# Altium schematic sheet PWR.SchDoc
size A4; SheetNumber: 8; SheetTotal: 8
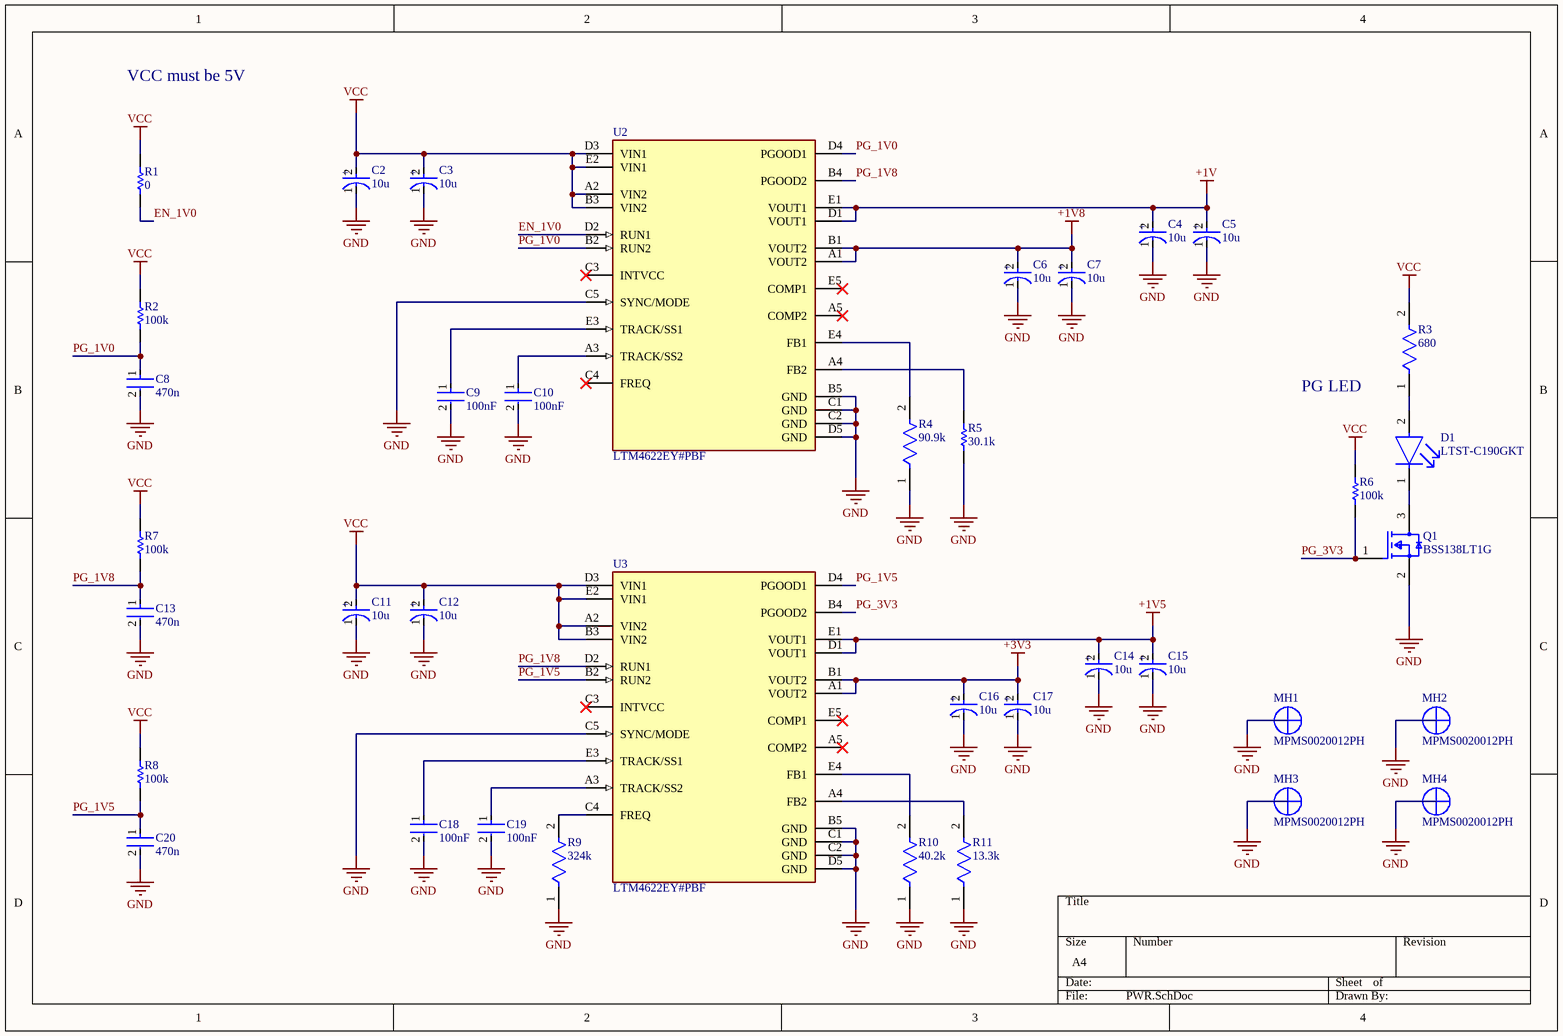
[diagram p0: PWR.SchDoc]

## Parts
C2  10u  [FP-TAJB-MFG]
C3  10u  [FP-TAJB-MFG]
C4  10u  [FP-TAJA-MFG]
C5  10u  [FP-TAJA-MFG]
C6  10u  [FP-TAJA-MFG]
C7  10u  [FP-TAJA-MFG]
C8  470n  [FP-C0603C-CF-MFG]
C9  100nF  [FP-CC0603-DA-MFG]
C10  100nF  [FP-CC0603-DA-MFG]
C11  10u  [FP-TAJB-MFG]
C12  10u  [FP-TAJB-MFG]
C13  470n  [FP-C0603C-CF-MFG]
C14  10u  [FP-TAJA-MFG]
C15  10u  [FP-TAJA-MFG]
C16  10u  [FP-TAJA-MFG]
C17  10u  [FP-TAJA-MFG]
C18  100nF  [FP-CC0603-DA-MFG]
C19  100nF  [FP-CC0603-DA-MFG]
C20  470n  [FP-C0603C-CF-MFG]
D1  LTST-C190GKT  [FP-LTST-C190GKT-MFG]
MH1  MPMS0020012PH  [BF-MPMS0020012PH]
MH2  MPMS0020012PH  [BF-MPMS0020012PH]
MH3  MPMS0020012PH  [BF-MPMS0020012PH]
MH4  MPMS0020012PH  [BF-MPMS0020012PH]
Q1  BSS138LT1G  [FP-318-MFG]
R1  0  [RESC1608X55X25ML10T15]
R2  100k  [RESC3116X65X40ML10T20]
R3  680  [FP-RT0603-MFG]
R4  90.9k  [FP-RT0603-MFG]
R5  30.1k  [RESC0603(1608)_N]
R6  100k  [RESC3116X65X40ML10T20]
R7  100k  [RESC3116X65X40ML10T20]
R8  100k  [RESC3116X65X40ML10T20]
R9  324k  [FP-RT0603-MFG]
R10  40.2k  [FP-RT0603-MFG]
R11  13.3k  [FP-RT0603-MFG]
U2  LTM4622EY#PBF  [FP-BGA-25-05-08-1502-MFG]
U3  LTM4622EY#PBF  [FP-BGA-25-05-08-1502-MFG]

## Nets
+1V: C4.2(A) C5.2(A) U2.D1(VOUT1) U2.E1(VOUT1)
+1V5: C14.2(A) C15.2(A) U3.D1(VOUT1) U3.E1(VOUT1)
+1V8: C6.2(A) C7.2(A) U2.A1(VOUT2) U2.B1(VOUT2)
+3V3: C16.2(A) C17.2(A) U3.A1(VOUT2) U3.B1(VOUT2)
GND: C2.1(C) C3.1(C) C4.1(C) C5.1(C) C6.1(C) C7.1(C) C8.2 C9.2 C10.2 C11.1(C) C12.1(C) C13.2 C14.1(C) C15.1(C) C16.1(C) C17.1(C) C18.2 C19.2 C20.2 MH1.1 MH2.1 MH3.1 MH4.1 Q1.2(S) R4.1 R5.1 R9.1 R10.1 R11.1 U2.B5(GND) U2.C1(GND) U2.C2(GND) U2.C5(SYNC/MODE) U2.D5(GND) U3.B5(GND) U3.C1(GND) U3.C2(GND) U3.C5(SYNC/MODE) U3.D5(GND)
VCC: C2.2(A) C3.2(A) C11.2(A) C12.2(A) R1.2 R2.2 R3.2 R6.2 R7.2 R8.2 U2.A2(VIN2) U2.B3(VIN2) U2.D3(VIN1) U2.E2(VIN1) U3.A2(VIN2) U3.B3(VIN2) U3.D3(VIN1) U3.E2(VIN1)
EN_1V0: R1.1 U2.D2(RUN1)
PG_1V0: C8.1 R2.1 U2.B2(RUN2) U2.D4(PGOOD1)
PG_1V5: C20.1 R8.1 U3.B2(RUN2) U3.D4(PGOOD1)
PG_1V8: C13.1 R7.1 U2.B4(PGOOD2) U3.D2(RUN1)
PG_3V3: Q1.1(G) R6.1 U3.B4(PGOOD2)
NetC9_1: C9.1 U2.E3(TRACK/SS1)
NetC10_1: C10.1 U2.A3(TRACK/SS2)
NetC18_1: C18.1 U3.E3(TRACK/SS1)
NetC19_1: C19.1 U3.A3(TRACK/SS2)
NetD1_1: D1.1(C) Q1.3(D)
NetD1_2: D1.2(A) R3.1
NetR4_2: R4.2 U2.E4(FB1)
NetR5_2: R5.2 U2.A4(FB2)
NetR9_2: R9.2 U3.C4(FREQ)
NetR10_2: R10.2 U3.E4(FB1)
NetR11_2: R11.2 U3.A4(FB2)

Not connected (* = marked no-connect by the designer): U2 A5(COMP2)* C3(INTVCC)* C4(FREQ)* E5(COMP1)*; U3 A5(COMP2)* C3(INTVCC)* E5(COMP1)*

## Notes on the sheet
- VCC must be 5V
- PG LED
- (in symbol CMP-2000-07217-2) +
- (in symbol CMP-04424-000481-1) +

## Library data of the parts
C2 C3 C11 C12 = CMP-04424-000481-1: 10uF 25V  ±10% 2.5Ω 1210  SMD Tantalum Capacitor; ESR (Equivalent Series Resistance): 2.5R; Polarity: Polar; Dissipation Factor: 6%; Leakage Current: 2.5uA; Lead Free: Lead Free; Capacitance: 10uF; Voltage Rating: 25V; Mount: Surface Mount; Packaging: Tape and Reel; Min Operating Temperature: -55°C; Weight: 0.000564oz; Series: TAJ; Case/Package: 1210; Width: 0.11inch; Height - Seated (Max): 0.083inch; RoHS Compliant: Yes; Height: 2.1mm; Depth: 2.8mm; Radiation Hardening: No; Construction: Flat; Max Operating Temperature: 125°C; Voltage Rating (DC): 25V; Features: General Purpose; REACH SVHC: No SVHC; Tolerance: 10%; Package Quantity: 1; Case Code (Metric): 3528; Termination: SMD/SMT; Case Code (Imperial): 1210; Length: 3.5mm
C4-C7 C14-C17 = CMP-2000-07217-2: 10uF 10V  ±10% 3Ω 1206  SMD Tantalum Capacitor; ESR (Equivalent Series Resistance): 3R; Dissipation Factor: 6%; Leakage Current: 1uA; Polarity: Polar; Q Factor: 6; Case Code (Imperial): 1206; RoHS Compliant: Yes; Case Code (Metric): 3216; Voltage Rating (DC): 10V; REACH SVHC: No SVHC; Mount: Surface Mount; Package Quantity: 1; Radiation Hardening: No; Width: 1.6mm; Depth: 1.6mm; Packaging: Tape and Reel; Termination: SMD/SMT; Length: 3.2mm; Tolerance: 10%; Features: General Purpose; Capacitance: 10uF; Case/Package: 1206; Max Operating Temperature: 125°C; Voltage Rating: 10V; Height - Seated (Max): 0.071inch; Series: TAJ; Height: 1.6mm; Min Operating Temperature: -55°C; Voltage: 10V; Number of Pins: 2; Construction: Flat; Dielectric Material: Tantalum; Lead Free: Lead Free
C8 C13 C20 = CMP-2006-03235-2: CAP CER 0.47UF 16V X7R 0603; Manufacturer Part Number: C0603C474K4RACTU; Manufacturer: KEMET; Automotive Grade: Grade 1; Value: 0.47 μF; Tolerance: 0.1; Temperature Coefficient: 30ppm/°C; Material: Ceramic; Device Class L3: Ceramic Capacitors; ComponentLink2URL: https://api.kemet.com/component-edge/download/datasheet/C0603C100J5GACAUTO.pdf; Height: 0.87mm; ComponentLink2Description: Datasheet; Device Class L2: Capacitors; Temperature Range Low: -55°C; Temperature Range High: +125°C; RoHS: TRUE; Mouser Description: 0603 C 470nF Ceramic Multilayer Capacitor, 16 V, +125degC, X7R Dielec, +/-10%; Temperature Characteristic: X7R; Digikey Description: CAP CER 0.47UF 16V X7R 0603; Lead Free: Yes; Automotive: Yes; Octopart: https://octopart.com/c0603c474k4ractu-kemet-109683; Capacitance: 0.47 μF; Package: C0603C-CF; Voltage Rating: 16 V; Device Class L1: Passive Components; Category: Cap; Temperature: -55°C to +125°C
C9 C10 C18 C19 = CMP-2100-03601-2: CAP CER 0.1UF 50V X7R 0603; Manufacturer: YAGEO; Manufacturer Part Number: CC0603KRX7R9BB104; Material: Ceramic; Temperature Coefficient: 15%; Tolerance: 0.1; Height: 0.9mm; Voltage: 50 V; ComponentLink2Description: Datasheet; Device Class L2: Capacitors; Temperature Range High: +125°C; Category: Cap; Capacitance: 100 nF; Footprint Url: http://www.yageo.com/exep/pages/download/literatures/UPY-C_GEN_24.pdf; ComponentLink2URL: http://www.yageo.com/documents/recent/UPY-GPHC_X7R_6.3V-to-50V_18.pdf; Package: CC0603-DA; Temperature: -55°C to +125°C; Voltage Rating: 50 V; Temperature Characteristic: X7R; Device Class L1: Passive Components; Temperature Range Low: -55°C; RoHS: TRUE; Automotive: No; Value: 100 nF; Device Class L3: Ceramic Capacitors; Octopart: https://octopart.com/cc0603krx7r9bb104-yageo-42244635; Mouser Description: Multilayer Ceramic Capacitor, CC Series, 0.1 - F, - 10%, X7R, 50 V, 0603 [1608 Metric]; Lead Free: Yes; Digikey Description: CAP CER 0.1UF 50V X7R 0603
D1 = CMP-22017-000005-2: LED GREEN CLEAR CHIP SMD; Dominant Wavelength: 569nm; Reverse Voltage: 5V; Lens Color: Colorless; Viewing Angle: 130°; Voltage: 2V; Forward Current: 30mA; Power Dissipation: 100mW; Luminous Intensity: 6mcd; Number of LEDs: 1; Forward Voltage: 2.1V; Wavelength: 565nm; Test Current: 10mA; Min Operating Temperature: -55°C; Lens Style: Clear; Mount: Surface Mount; Width: 0.8mm; Packaging: Tape and Reel; Lens Transparency: Clear; Case Code (Metric): 1608; Depth: 0.8mm; Case Code (Imperial): 0603; Case/Package: 0603; Number of Pins: 2; Max Operating Temperature: 85°C; Lead Free: Lead Free; Number of Elements: 1; Length: 1.6mm; Height: 0.8mm; Package Quantity: 1; Power Rating: 100mW; Radiation Hardening: No; Illumination Color: Green; Color: Green
MH1-MH4 = CMP-00028-00000-2: Copper Pillar, M2 Screw; Manufacturer: B&F Fastener Supply; Drive Type: Phillips; Screw Head Type: PanHead; Mounting Technology: TH; Datasheet URL: https://datasheet.ciiva.com/1034/metd7985a-1034196.pdf; Thread Size: M2; Case/Package: MPMS0020012PH; Package Reference: MPMS0020012PH; Datasheet Version: 42095; Pins: 1; Package Description: 1-Pin Surface Mount Device, Diameter 3.7 mm; Type: MachineScrew; Manufacturer URL: http://www.bffastenersupply.com/; RoHS Compliant: False
Q1 = CMP-1058-00767-2: Manufacturer Lifecycle Status: ACTIVE; NexarPartId: 5035; Input Capacitance: 50pF; Element Configuration: Single; Voltage Rating (DC): 50V; Continuous Drain Current (ID): 200mA; Turn-On Delay Time: 20ns; Nominal Vgs: 1.5V; Max Junction Temperature (Tj): 150°C; Number of Channels: 1; Gate to Source Voltage (Vgs): 20V; Drain to Source Resistance: 3.5Ω; Max Power Dissipation: 225mW; Number of Pins: 3; Max Operating Temperature: 150°C; Contact Plating: Tin; Height: 1.01mm; Drain to Source Breakdown Voltage: 50V; Lead Free: Lead Free; Drain to Source Voltage (Vdss): 50V; Rds On Max: 3.5Ω; Packaging: Cut Tape; REACH SVHC: No SVHC; Radiation Hardening: No; Halogen Free: Halogen Free; Current Rating: 200mA; Number of Elements: 1; RoHS: Compliant; Min Operating Temperature: -55°C; Case/Package: SOT-23-3; Lifecycle Status: Production; Width: 1.4mm; Schedule B: 8541210080; Threshold Voltage: 1.5V; Power Dissipation: 225mW; Resistance: 3.5Ω; Length: 3.04mm; Turn-Off Delay Time: 20ns
R1 = CMP-2100-03667-1: Chip Resistor, 0 Ohm, +/- 5%, 0.1 W, -55 to 155 degC, 0603 (1608 Metric), RoHS, Tape and Reel; Manufacturer: Yageo; Temperature Coefficient: 200ppm/degreesC; Voltage Rating: 50V; Power Rating: 100mW; Resistance: 0mOhm; Width: 0.8mm; Max Operating Temperature: 155degC; Tolerance: 5%; Package Reference: 0603; Height: 0.45mm; Depth: 0.8mm; Package Description: 2-Pin Surface Mount Device, Body 1.6 x 0.8 mm; Termination: SMD/SMT; Package Quantity: 5000; Case/Package: 0603; Case Code (Imperial): 0603; Radiation Hardening: No; Number of Pins: 2; Length: 1.6mm; Lead Free: LeadFree; Voltage Rating (DC): 50V; Military Standard: Not; Datasheet URL: http://www.yageo.com/NewPortal/yageodocoutput?fileName=/pdf/R-Chip/PYu-RC_Group_51_RoHS_L_5.pdf; Manufacturer URL: http://www.yageo.com/; Packaging: TapeandReel; Case Code (Metric): 1608; Min Operating Temperature: -55degC; Composition: ThickFilm; RoHSCompliant: true; Contact Plating: Tin; Datasheet Version: Rev. 5, 10/2016; REACH SVHC: NoSVHC
R2 R6-R8 = CMP-2100-03674-1: Chip Resistor, 100 KOhm, +/- 1%, 0.25 W, -55 to 155 degC, 1206 (3216 Metric), RoHS, Tape and Reel; Manufacturer: Yageo; Voltage Rating: 200V; Temperature Coefficient: 100ppm/degreesC; Power Rating: 250mW; Case Code (Metric): 3216; Composition: ThickFilm; Lead Free: LeadFree; Max Operating Temperature: 155degC; Case/Package: 1206; Min Operating Temperature: -55degC; Depth: 1.6mm; RoHSCompliant: true; Datasheet URL: http://www.yageo.com/NewPortal/yageodocoutput?fileName=/pdf/R-Chip/PYu-RC_Group_51_RoHS_L_5.pdf; Datasheet Version: Rev. 5, 10/2016; Package Reference: 1206.0; Packaging: TapeandReel; Resistance: 100KOhm; Manufacturer URL: http://www.yageo.com/; Tolerance: 1%; Height: 0.55mm; REACH SVHC: NoSVHC; Case Code (Imperial): 1206; Length: 3.1mm; Package Description: 2-Pin Surface Mount Device, Body 3.1 x 1.6 mm; Termination: SMD/SMT
R3 = CMP-2000-04548-2: RES SMD 680 OHM 0.1% 1/10W 0603; Manufacturer Part Number: RT0603BRE07680RL; Manufacturer: Yageo; Power Rating: 0.1W; Tolerance: 0.001; Temperature Coefficient: 50 ppm/°C; Resistance: 680Ω; Value: 680Ω; Voltage Rating: 75V; Composition: Thin Film; Temperature Range Low: -55°C; Temperature: -55°C to +155°C; ComponentLink2URL: http://www.yageo.com/documents/recent/PYu-RT_1-to-0.01_RoHS_L_9.pdf; Package: RT0603; Device Class L2: Resistors; Height: 0.55mm; Ipc Land Pattern Name: RESC16080X45; Device Class L3: Chip SMD Resistors; Temperature Range High: +155°C; Device Class L1: Passive Components; RoHS: TRUE; Series: RT; Octopart: https://octopart.com/rt0603bre07680rl-yageo-1284352; Footprint Url: http://www.yageo.com/exep/pages/download/literatures/PYu-R_Mount_10.pdf; ComponentLink2Description: Datasheet; Lead Free: Yes; Digikey Description: RES SMD 680 OHM 0.1% 1/10W 0603; Automotive: No; Category: Res
R4 = CMP-2000-04509-2: RES 90.9K OHM 1/10W .1% SMD 0603; Manufacturer Part Number: RT0603BRD0790K9L; Manufacturer: Yageo; Temperature Coefficient: 25 ppm/°C; Voltage Rating: 75V; Power Rating: 0.1W; Resistance: 90.9KΩ; Tolerance: 0.001; Value: 90.9KΩ; Series: RT; Device Class L3: Chip SMD Resistors; Footprint Url: http://www.yageo.com/exep/pages/download/literatures/PYu-R_Mount_10.pdf; ComponentLink2Description: Datasheet; Temperature Range High: +155°C; Height: 0.55mm; RoHS: TRUE; Composition: Thin Film; ComponentLink2URL: http://www.yageo.com/documents/recent/PYu-RT_1-to-0.01_RoHS_L_9.pdf; Package: RT0603; Octopart: https://octopart.com/rt0603brd0790k9l-yageo-1479181; Category: Res; Lead Free: Yes; Device Class L2: Resistors; Mouser Description: Thin Film Resistors - SMD 1/10W 90.9K ohm .1% 25ppm; Temperature: -55°C to +155°C; Digikey Description: RES 90.9K OHM 1/10W .1% SMD 0603; Temperature Range Low: -55°C; Automotive: No; Ipc Land Pattern Name: RESC16080X45; Device Class L1: Passive Components
R5 = CMP-1012-00676-1: 30K1 0.1W 1% 0603 (1608 Metric)  SMD; Case-Metric: 1608; Case-EIA: 0603; Value: 30100.00 Ohm; Tolerance: 1 %; Power: 0.1 W; Technology: SMT
R9 = CMP-03412-024739-1: RES SMD 324K OHM 1% 1/10W 0603; Manufacturer: Yageo; Manufacturer Part Number: RT0603FRD07324KL; Tolerance: 0.01; Resistance: 324KΩ; Voltage Rating: 75V; Power Rating: 0.1W; Value: 324KΩ; Temperature Coefficient: 25 ppm/°C; Temperature: -55°C to +155°C; Device Class L3: Chip SMD Resistors; Automotive: No; Series: RT; Octopart: https://octopart.com/rt0603frd07324kl-yageo-71395357; Composition: Thin Film; Ipc Land Pattern Name: RESC16080X45; Package: RT0603; Lead Free: Yes; Footprint Url: http://www.yageo.com/exep/pages/download/literatures/PYu-R_Mount_10.pdf; ComponentLink2Description: Datasheet; Temperature Range Low: -55°C; Digikey Description: RES SMD 324K OHM 1% 1/10W 0603; Device Class L1: Passive Components; Category: Res; Temperature Range High: +155°C; RoHS: TRUE; Height: 0.55mm; Device Class L2: Resistors; ComponentLink2URL: http://www.yageo.com/documents/recent/PYu-RT_1-to-0.01_RoHS_L_9.pdf
R10 = CMP-2000-04455-2: RES SMD 40.2K OHM 0.1% 1/10W; Manufacturer: Yageo; Manufacturer Part Number: RT0603BRD0740K2L; Temperature Coefficient: 25 ppm/°C; Power Rating: 0.1W; Value: 40.2KΩ; Voltage Rating: 75V; Tolerance: 0.001; Package: RT0603; Octopart: https://octopart.com/rt0603brd0740k2l-yageo-1425510; Automotive: No; ComponentLink2URL: http://www.yageo.com/documents/recent/PYu-RT_1-to-0.01_RoHS_L_9.pdf; RoHS: TRUE; Mouser Description: Thin Film Resistors 1/10W 40.2K ohm .1% 25ppm; Series: RT; Lead Free: Yes; Ipc Land Pattern Name: RESC16080X45; ComponentLink2Description: Datasheet; Temperature Range Low: -55°C; Device Class L3: Chip SMD Resistors; Temperature: -55°C to +155°C; Resistance: 40.2KΩ; Device Class L2: Resistors; Footprint Url: http://www.yageo.com/exep/pages/download/literatures/PYu-R_Mount_10.pdf; Temperature Range High: +155°C; Composition: Thin Film; Digikey Description: RES SMD 40.2K OHM 0.1% 1/10W; Category: Res; Height: 0.55mm; Device Class L1: Passive Components
R11 = CMP-03412-026065-1: RES 13.3KOHM 1/10W .1% SMD 0603; Manufacturer: Yageo; Manufacturer Part Number: RT0603BRE0713K3L; Value: 13.3KΩ; Temperature Coefficient: 50 ppm/°C; Tolerance: 0.001; Power Rating: 0.1W; Voltage Rating: 75V; Height: 0.55mm; Ipc Land Pattern Name: RESC16080X45; Digikey Description: RES 13.3KOHM 1/10W .1% SMD 0603; ComponentLink2URL: http://www.yageo.com/documents/recent/PYu-RT_1-to-0.01_RoHS_L_9.pdf; Temperature Range High: +155°C; Octopart: https://octopart.com/rt0603bre0713k3l-yageo-1414952; Package: RT0603; Composition: Thin Film; ComponentLink2Description: Datasheet; Device Class L3: Chip SMD Resistors; RoHS: TRUE; Automotive: No; Category: Res; Temperature: -55°C to +155°C; Temperature Range Low: -55°C; Lead Free: Yes; Mouser Description: Res Thin Film 0603 13.3K Ohm 0.1% 1/10W ±50ppm/°C Molded SMD Paper T/R; Device Class L2: Resistors; Footprint Url: http://www.yageo.com/exep/pages/download/literatures/PYu-R_Mount_10.pdf; Series: RT; Resistance: 13.3KΩ; Device Class L1: Passive Components
U2 U3 = CMP-09139-000313-1: DC DC CNVRTR 0.6-5.5V 0.6-5.5V; Max Output Current: 2.5A; Output Current: 5A; Min Output Voltage: 600mV; Max Input Voltage: 20V; Min Input Voltage: 3.6V; Switching Frequency: 1MHz; Number of Outputs: 2; Max Output Voltage: 5.5V; REACH SVHC: No SVHC; Mount: Surface Mount; Number of Pins: 25; Case/Package: BGA; Packaging: Tray; RoHS Compliant: Yes; Min Operating Temperature: -40°C; Height: 0.07inch; Features: OVP; Length: 0.25inch; Max Operating Temperature: 125°C; Voltage - Output 1: 5.5V; Width: 0.25inch